# EAGLE schematic Button V0.2 (EAGLE 9.5.1)
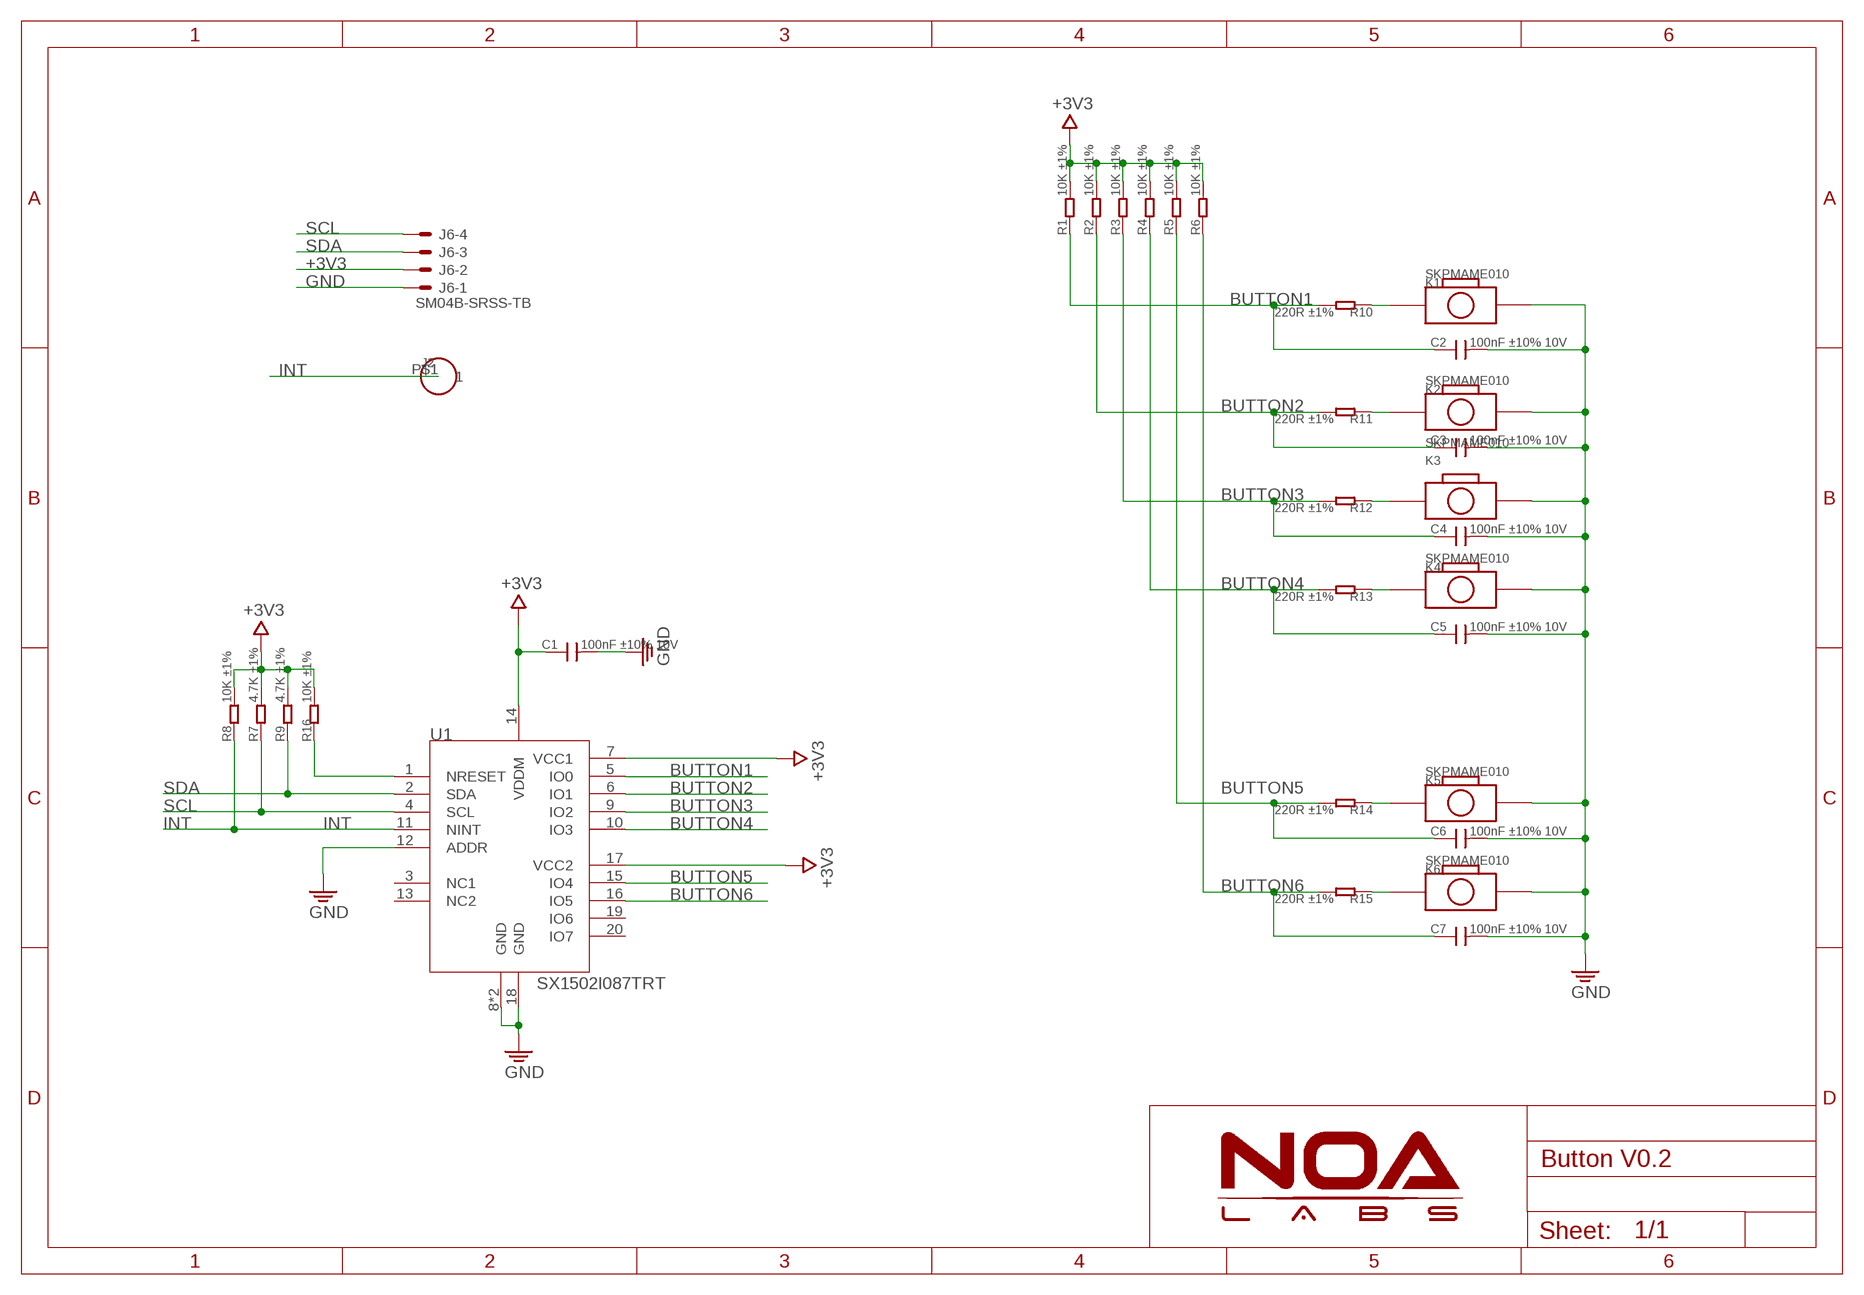
[diagram p0: schematic, sheet 1]

## Parts
C1  100nF ±10% 10V  C-0402  [C0402]
C2  100nF ±10% 10V  C-0402  [C0402]
C3  100nF ±10% 10V  C-0402  [C0402]
C4  100nF ±10% 10V  C-0402  [C0402]
C5  100nF ±10% 10V  C-0402  [C0402]
C6  100nF ±10% 10V  C-0402  [C0402]
C7  100nF ±10% 10V  C-0402  [C0402]
J2  HEADER-1P-32  [1P-60/32MIL]
J6  SM04B-SRSS-TB  [SM04B-SRSS-TB]
K1  SKPMAME010  BUTTON-2PSKPMAME010  [SKPMAME010]
K2  SKPMAME010  BUTTON-2PSKPMAME010  [SKPMAME010]
K3  SKPMAME010  BUTTON-2PSKPMAME010  [SKPMAME010]
K4  SKPMAME010  BUTTON-2PSKPMAME010  [SKPMAME010]
K5  SKPMAME010  BUTTON-2PSKPMAME010  [SKPMAME010]
K6  SKPMAME010  BUTTON-2PSKPMAME010  [SKPMAME010]
R1  10K ±1%  R-0402  [R0402]
R2  10K ±1%  R-0402  [R0402]
R3  10K ±1%  R-0402  [R0402]
R4  10K ±1%  R-0402  [R0402]
R5  10K ±1%  R-0402  [R0402]
R6  10K ±1%  R-0402  [R0402]
R7  4.7K ±1%  R-0402  [R0402]
R8  10K ±1%  R-0402  [R0402]
R9  4.7K ±1%  R-0402  [R0402]
R10  220R ±1%  R-0402  [R0402]
R11  220R ±1%  R-0402  [R0402]
R12  220R ±1%  R-0402  [R0402]
R13  220R ±1%  R-0402  [R0402]
R14  220R ±1%  R-0402  [R0402]
R15  220R ±1%  R-0402  [R0402]
R16  10K ±1%  R-0402  [R0402]
U1  SX1502I087TRT  SX1502  [QFN-20-3X3MM]

## Nets
+3V3: C1.1 J6.2 R1.2 R2.2 R3.2 R4.2 R5.2 R6.2 R7.2 R8.2 R9.2 R16.2 U1.7(VCC1) U1.14(VDDM) U1.17(VCC2)
BUTTON1: C2.1 R1.1 R10.2 U1.5(IO0)
BUTTON2: C3.1 R2.1 R11.2 U1.6(IO1)
BUTTON3: C4.1 R3.1 R12.2 U1.9(IO2)
BUTTON4: C5.1 R4.1 R13.2 U1.10(IO3)
BUTTON5: C6.1 R5.1 R14.2 U1.15(IO4)
BUTTON6: C7.1 R6.1 R15.2 U1.16(IO5)
GND: C1.2 C2.2 C3.2 C4.2 C5.2 C6.2 C7.2 J6.1 K1.2 K2.2 K3.2 K4.2 K5.2 K6.2 U1.8(GND) U1.12(ADDR) U1.18(GND) U1.21(GND)
INT: J2.P$1 R8.1 U1.11(NINT)
N$1: K1.1 R10.1
N$2: K2.1 R11.1
N$3: K3.1 R12.1
N$4: K4.1 R13.1
N$5: K5.1 R14.1
N$6: K6.1 R15.1
N$9: R16.1 U1.1(NRESET)
SCL: J6.4 R7.1 U1.4(SCL)
SDA: J6.3 R9.1 U1.2(SDA)
Unconnected: U1.3(NC1) U1.13(NC2) U1.19(IO6) U1.20(IO7)

## Library data of the parts
C1-C7 = RCL:C
J2 = Connector_NOA:HEADER-1P
J6 = Connector_NOA:?M04B-SRSS-TB: Disconnectable Crimp style connector, 1.0mm pitch 4 contacts
K1-K6 = Discrete_NOA:BUTTON-2P
R1-R16 = RCL:R
U1 = IC_NOA:SX1502

## Net classes
0 Normal: width 0.102 mm, drill 0.2 mm, clearance 0.102 mm